# Altium schematic sheet usb.SchDoc
size A4 portrait
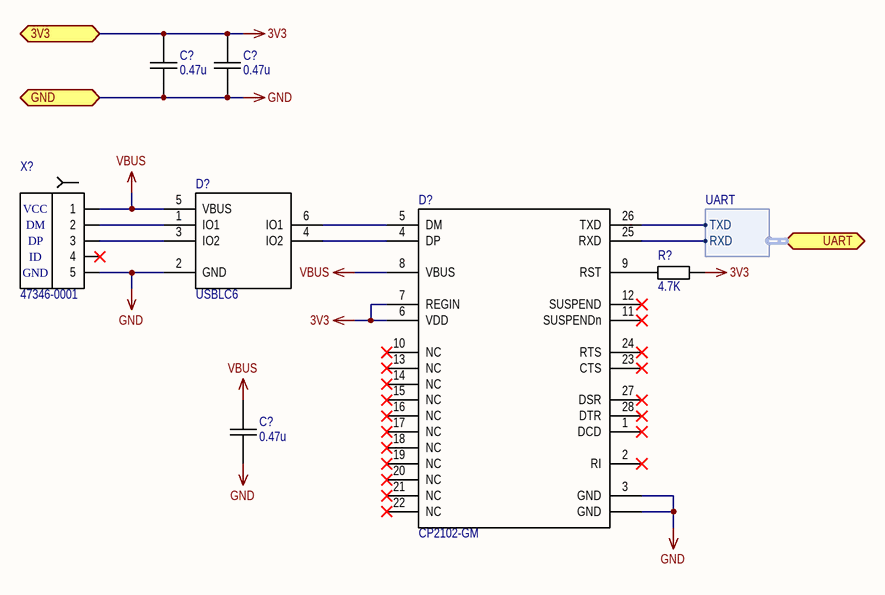
[diagram p0: usb.SchDoc]

## Parts
(Parts that share a designator on the sheet are numbered #1, #2 ... from top to bottom, then left to right.)
C?#1  value 0.47u  [CAP-0402]  (hidden comment: CAP-0.47u-10%-50V-X7R-0402)
C?#2  value 0.47u  [CAP-0402]  (hidden comment: CAP-0.47u-10%-50V-X7R-0402)
C?#3  value 0.47u  [CAP-0402]  (hidden comment: CAP-0.47u-10%-50V-X7R-0402)
D?#1  USBLC6  [SOT23-6]
D?#2  CP2102-GM  [QFN-28-5x5]
R?  value 4.7K  [RES-0402]  (hidden comment: RES-4.7K-1%-0.063-0402)
X?  47346-0001  [473460001]

## Ports
3V3 (bidir), GND (bidir), UART (bidir, harness UART)

## Harnesses
UART: TXD, RXD

## Nets
3V3: C?#1.2 C?#2.2 D?#2.6(VDD) D?#2.7(REGIN) R?.1 ; port 3V3
GND: C?#1.1 C?#2.1 C?#3.1 D?#1.2(GND) D?#2.3(GND) D?#2.PAD(GND) X?.5 ; port GND
VBUS: C?#3.2 D?#1.5(VBUS) D?#2.8(VBUS) X?.1
NetD?#1_1: D?#1.1(IO1) X?.2
NetD?#1_3: D?#1.3(IO2) X?.3
NetD?#1_4: D?#1.4(IO2) D?#2.4(DP)
NetD?#1_6: D?#1.6(IO1) D?#2.5(DM)
NetD?#2_9: D?#2.9(RST) R?.2
NetD?#2_25: D?#2.25(RXD) ; port UART.RXD
NetD?#2_26: D?#2.26(TXD) ; port UART.TXD

Not connected (* = marked no-connect by the designer): D?#2 1(DCD)* 2(RI)* 10(NC)* 11(SUSPENDn)* 12(SUSPEND)* 13(NC)* 14(NC)* 15(NC)* 16(NC)* 17(NC)* 18(NC)* 19(NC)* 20(NC)* 21(NC)* 22(NC)* 23(CTS)* 24(RTS)* 27(DSR)* 28(DTR)*; X? 4*

## Notes on the sheet
- (in symbol USB-Micro-B) VCC; DM; DP; ID; GND

## Library data of the parts
C?#1-C?#3 = CAP-0402: Конденсатор; Tolerance: 10; Voltage: 50; Part Number: *; Manufacturer: *; Temperature: X7R
D?#1 = USBLC6: Интегральная микросхема; Manufacturer: TI; Part Number: USBLC6
D?#2 = CP2102: Интегральная микросхема; Manufacturer: SiLabs; Part Number: CP2102-GM
R? = RES-0402: Резистор; Tolerance: 1; Power: 0.063; Part Number: *; Manufacturer: *
X? = USB-Micro-B: Manufacturer: Molex; Part Number: 47346-0001